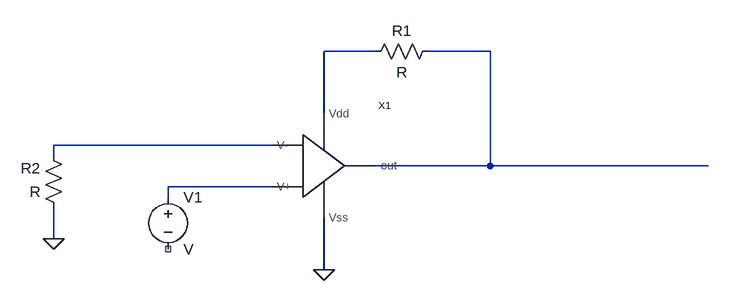
[diagram p0: schematic Draft8.asc]
Draft8.asc, the LTspice schematic file:
Version 4
SHEET 1 880 680
WIRE 352 -32 272 -32
WIRE 528 -32 432 -32
WIRE 272 64 272 -32
WIRE 192 112 -144 112
WIRE -144 128 -144 112
WIRE 528 144 528 -32
WIRE 528 144 352 144
WIRE 864 144 528 144
WIRE 192 176 32 176
WIRE 32 192 32 176
WIRE -144 256 -144 208
WIRE 272 304 272 224
FLAG -144 256 0
FLAG 272 304 0
SYMBOL OPAMP 160 144 R0
SYMATTR InstName X1
SYMBOL res 448 -48 R90
WINDOW 0 0 56 VBottom 2
WINDOW 3 32 56 VTop 2
SYMATTR InstName R1
SYMBOL res -128 224 R180
WINDOW 0 36 76 Left 2
WINDOW 3 36 40 Left 2
SYMATTR InstName R2
SYMBOL voltage 32 176 R0
SYMATTR InstName V1

The netlist it stands for:
* Draft8.asc
XX1 N001 0 N003 N004 N002 OPAMP  ; pins Vdd Vss V- V+ out
R1 N002 N001 R
R2 0 N003 R
V1 N004 NC_01 V
.backanno
.end